# Altium schematic sheet COMS0010_Comms_Test_Board.SchDoc: BLUEsat Communications Test Board
size A3; DrawnBy: Thomas Fisk; Engineer: T. FISK; Organization: BLUEsat Project; Address1: Room 419; Address2: School of EE&T; Address3: UNSW, NSW 2052; Address4: Australia; DocumentNumber: COMS0005; SheetNumber: 1; SheetTotal: 1; Description: Test board for communications subsystem.; Version: 1.0
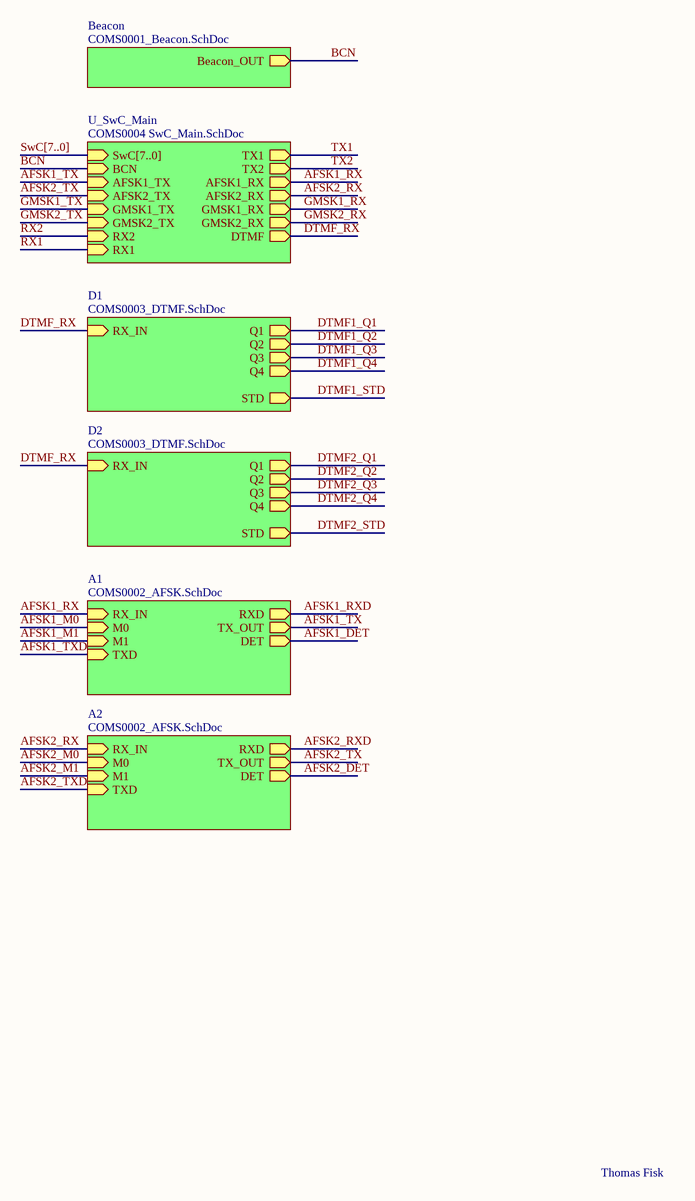
[diagram p0: COMS0010_Comms_Test_Board.SchDoc]

## Sub-sheets
A1 = COMS0002_AFSK.SchDoc: RX_IN (in), M0 (in), M1 (in), TXD (in), RXD (out), TX_OUT (out), DET (out)
A2 = COMS0002_AFSK.SchDoc: RX_IN (in), M0 (in), M1 (in), TXD (in), RXD (out), TX_OUT (out), DET (out)
Beacon = COMS0001_Beacon.SchDoc: Beacon_OUT (out)
D1 = COMS0003_DTMF.SchDoc: Q1 (out), RX_IN (in), STD (out), Q2 (out), Q3 (out), Q4 (out)
D2 = COMS0003_DTMF.SchDoc: Q1 (out), RX_IN (in), STD (out), Q2 (out), Q3 (out), Q4 (out)
U_SwC_Main = COMS0004 SwC_Main.SchDoc: SwC[7..0] (in), BCN (in), AFSK1_TX (in), AFSK2_TX (in), GMSK1_TX (in), GMSK2_TX (in), TX1 (out), TX2 (out), RX2 (in), RX1 (in), AFSK1_RX (out), AFSK2_RX (out), GMSK1_RX (out), GMSK2_RX (out), DTMF (out)

## Nets
AFSK1_DET: sheet A1/DET
AFSK1_M0: sheet A1/M0
AFSK1_M1: sheet A1/M1
AFSK1_RX: sheet U_SwC_Main/AFSK1_RX, sheet A1/RX_IN
AFSK1_RXD: sheet A1/RXD
AFSK1_TX: sheet U_SwC_Main/AFSK1_TX, sheet A1/TX_OUT
AFSK1_TXD: sheet A1/TXD
AFSK2_DET: sheet A2/DET
AFSK2_M0: sheet A2/M0
AFSK2_M1: sheet A2/M1
AFSK2_RX: sheet U_SwC_Main/AFSK2_RX, sheet A2/RX_IN
AFSK2_RXD: sheet A2/RXD
AFSK2_TX: sheet U_SwC_Main/AFSK2_TX, sheet A2/TX_OUT
AFSK2_TXD: sheet A2/TXD
BCN: sheet Beacon/Beacon_OUT, sheet U_SwC_Main/BCN
DTMF1_Q1: sheet D1/Q1
DTMF1_Q2: sheet D1/Q2
DTMF1_Q3: sheet D1/Q3
DTMF1_Q4: sheet D1/Q4
DTMF1_STD: sheet D1/STD
DTMF2_Q1: sheet D2/Q1
DTMF2_Q2: sheet D2/Q2
DTMF2_Q3: sheet D2/Q3
DTMF2_Q4: sheet D2/Q4
DTMF2_STD: sheet D2/STD
DTMF_RX: sheet U_SwC_Main/DTMF, sheet D1/RX_IN, sheet D2/RX_IN
GMSK1_RX: sheet U_SwC_Main/GMSK1_RX
GMSK1_TX: sheet U_SwC_Main/GMSK1_TX
GMSK2_RX: sheet U_SwC_Main/GMSK2_RX
GMSK2_TX: sheet U_SwC_Main/GMSK2_TX
RX1: sheet U_SwC_Main/RX1
RX2: sheet U_SwC_Main/RX2
TX1: sheet U_SwC_Main/TX1
TX2: sheet U_SwC_Main/TX2

## Buses and harness runs
bus SwC[7..0] = sheet U_SwC_Main/SwC[7..0]

## Notes on the sheet
- Thomas Fisk
- Title
- Description:
- Size:
- Author:
- Date:
- A3
- Time:
- Version
- Sheet:
- Drawing No.:
- of
- File: